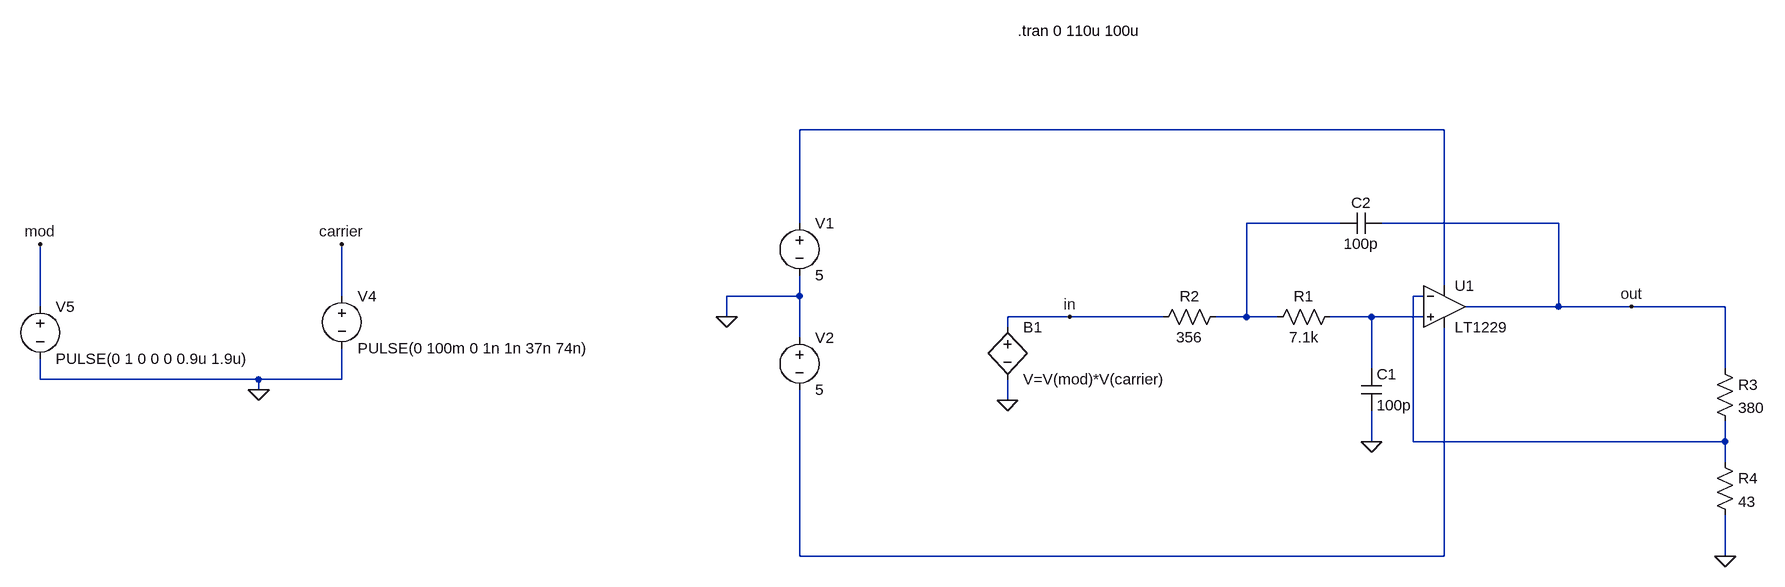
[diagram p0: schematic Draft2.asc]
Draft2.asc, the LTspice schematic file:
Version 4
SHEET 1 880 680
WIRE 160 -112 -832 -112
WIRE -832 32 -832 -112
WIRE 0 32 -144 32
WIRE 336 32 64 32
WIRE 160 128 160 -112
WIRE -1536 144 -1536 64
WIRE -832 144 -832 112
WIRE -832 144 -944 144
WIRE 128 144 112 144
WIRE -2000 160 -2000 64
WIRE 336 160 336 32
WIRE 336 160 192 160
WIRE 448 160 336 160
WIRE 592 160 448 160
WIRE -944 176 -944 144
WIRE -416 176 -512 176
WIRE -272 176 -416 176
WIRE -144 176 -144 32
WIRE -144 176 -192 176
WIRE -96 176 -144 176
WIRE 48 176 -16 176
WIRE 128 176 48 176
WIRE -512 192 -512 176
WIRE -832 208 -832 144
WIRE 48 256 48 176
WIRE 592 256 592 160
WIRE -2000 272 -2000 240
WIRE -1664 272 -2000 272
WIRE -1536 272 -1536 224
WIRE -1536 272 -1664 272
WIRE -1664 288 -1664 272
WIRE -512 304 -512 272
WIRE 48 368 48 320
WIRE 112 368 112 144
WIRE 592 368 592 336
WIRE 592 368 112 368
WIRE 592 400 592 368
WIRE -832 544 -832 288
WIRE 160 544 160 192
WIRE 160 544 -832 544
WIRE 592 544 592 480
FLAG -944 176 0
FLAG -512 304 0
FLAG 592 544 0
FLAG 448 160 out
FLAG -416 176 in
FLAG 48 368 0
FLAG -1664 288 0
FLAG -2000 64 mod
FLAG -1536 64 carrier
SYMBOL Opamps\\LT1229 160 96 R0
SYMATTR InstName U1
SYMBOL voltage -832 16 R0
WINDOW 123 0 0 Left 2
WINDOW 39 0 0 Left 2
SYMATTR InstName V1
SYMATTR Value 5
SYMBOL voltage -832 192 R0
WINDOW 123 0 0 Left 2
WINDOW 39 0 0 Left 2
SYMATTR InstName V2
SYMATTR Value 5
SYMBOL res 0 160 R90
WINDOW 0 0 56 VBottom 2
WINDOW 3 32 56 VTop 2
SYMATTR InstName R1
SYMATTR Value 7.1k
SYMBOL res -176 160 R90
WINDOW 0 0 56 VBottom 2
WINDOW 3 32 56 VTop 2
SYMATTR InstName R2
SYMATTR Value 356
SYMBOL cap 32 256 R0
SYMATTR InstName C1
SYMATTR Value 100p
SYMBOL cap 64 16 R90
WINDOW 0 0 32 VBottom 2
WINDOW 3 32 32 VTop 2
SYMATTR InstName C2
SYMATTR Value 100p
SYMBOL res 576 240 R0
SYMATTR InstName R3
SYMATTR Value 380
SYMBOL res 576 384 R0
SYMATTR InstName R4
SYMATTR Value 43
SYMBOL voltage -1536 128 R0
WINDOW 123 0 0 Left 2
WINDOW 39 0 0 Left 2
SYMATTR InstName V4
SYMATTR Value PULSE(0 100m 0 1n 1n 37n 74n)
SYMBOL voltage -2000 144 R0
WINDOW 123 0 0 Left 2
WINDOW 39 0 0 Left 2
SYMATTR InstName V5
SYMATTR Value PULSE(0 1 0 0 0 0.9u 1.9u)
SYMBOL bv -512 176 R0
SYMATTR InstName B1
SYMATTR Value V=V(mod)*V(carrier)
TEXT -496 -264 Left 2 !.tran 0 110u 100u

The netlist it stands for:
* Draft2.asc
XU1 N004 N003 N001 N005 out LT1229  ; pins In+ In- V+ V- OUT
V1 N001 0 5
V2 0 N005 5
R1 N004 N002 7.1k
R2 N002 in 356
C1 N004 0 100p
C2 out N002 100p
R3 out N003 380
R4 N003 0 43
V4 carrier 0 PULSE(0 100m 0 1n 1n 37n 74n)
V5 mod 0 PULSE(0 1 0 0 0 0.9u 1.9u)
B1 in 0 V=V(mod)*V(carrier)
.tran 0 110u 100u
.backanno
.end